# EAGLE design SOT23-6 (EAGLE 7.3.0)
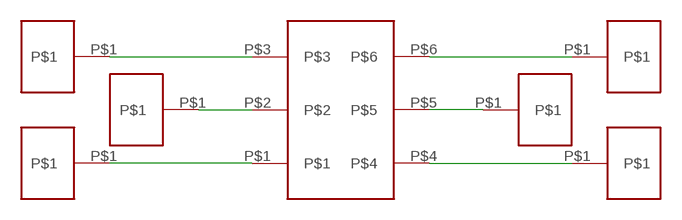
[diagram p0: schematic, sheet 1]

## Parts
U$1  SOT23-6  [SOT23-6]
U$2  PAD50X100MIL  [100X50MIL_PAD]
U$3  PAD50X100MIL  [100X50MIL_PAD]
U$4  PAD50X100MIL  [100X50MIL_PAD]
U$5  PAD50X100MIL  [100X50MIL_PAD]
U$6  PAD50X100MIL  [100X50MIL_PAD]
U$7  PAD50X100MIL  [100X50MIL_PAD]

## Nets
N$1: U$1.P$3 U$3.P$1
N$2: U$1.P$2 U$2.P$1
N$3: U$1.P$1 U$4.P$1
N$4: U$1.P$6 U$6.P$1
N$5: U$1.P$5 U$5.P$1
N$6: U$1.P$4 U$7.P$1

## Library data of the parts
U$1 = generic_smd:SOT23-6
U$2-U$7 = generic_smd:PAD

## Board
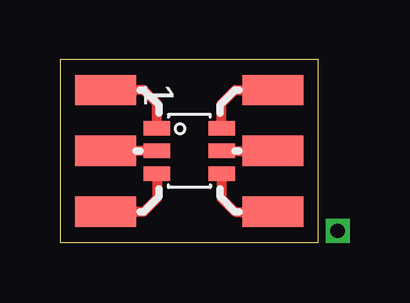
[diagram p1: board, top side]
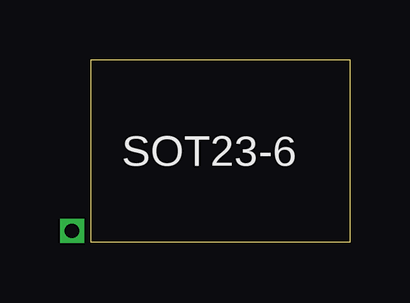
[diagram p2: board, bottom side, seen from below]

Size 10.78 x 7.61 mm. Coordinates in mm from the lower left corner, seen from the top.
Outline: 0,0 10.78,0 10.78,7.61 0,7.61 0,0
Copper layers (1*16): Top 0.035mm / dielectric 1.5mm / Bottom 0.035mm
Design rules "default": minimum track width 10mil, minimum drill 24mil, track to track 8mil, track to pad 8mil, pad to pad 8mil, via to via 8mil, smd to smd 8mil, copper to edge 40mil, drill to drill 8mil, minimum pad ring 10mil, minimum via ring 8mil, stop-mask expansion 4mil, vias tented up to drill 0mil, thermal gap 10mil

### Footprints (pad centres in the part's own frame; a part is rotated, then mirrored left to right if it is on the bottom)
SOT23-6 = smd 0.6 x 1.1: P$1 -0.95,-1.35; P$2 0,-1.35; P$3 0.95,-1.35; P$4 0.95,1.35; P$5 0,1.35; P$6 -0.95,1.35
100X50MIL_PAD = smd 1.27 x 2.54: P$1 0,0

### Placement (x,y rotation side)
U$1  5.4,3.81 270 top
U$2  1.91,3.81 90 top
U$3  1.91,1.27 90 top
U$4  1.91,6.35 90 top
U$5  8.89,3.81 90 top
U$6  8.89,6.35 90 top
U$7  8.89,1.27 90 top

### Tracks (layer width: path | path; a pad name or v marks a point on that pad's centre or on a via)
N$1
  Top 0.406: U$1.P$3 4.05,1.82 3.49,1.27 U$3.P$1
N$2
  Top 0.406: U$1.P$2 U$2.P$1
N$3
  Top 0.406: U$1.P$1 4.05,5.79 3.49,6.35 U$4.P$1
N$4
  Top 0.406: U$1.P$6 6.75,5.79 7.3,6.35 U$6.P$1
N$5
  Top 0.406: U$1.P$5 U$5.P$1
N$6
  Top 0.406: U$1.P$4 6.75,1.82 7.3,1.27 U$7.P$1
N$7  (via drill 0.6)
  other vias: 11.59,0.48

### Text on the board
tPlace: 1
bPlace: SOT23-6
Document: via required to force drill file creation